# Altium schematic sheet fillcap_driver.SchDoc: Driver
size A3; DrawnBy: daniw / ninux; Organization: HSLU T&A; Address1: Abteilung Elektrotechnik; Address2: Technikumsstrasse 21; Address3: CH-6048 Horw; SheetNumber: 2; SheetTotal: 9; Projektname: fillcap
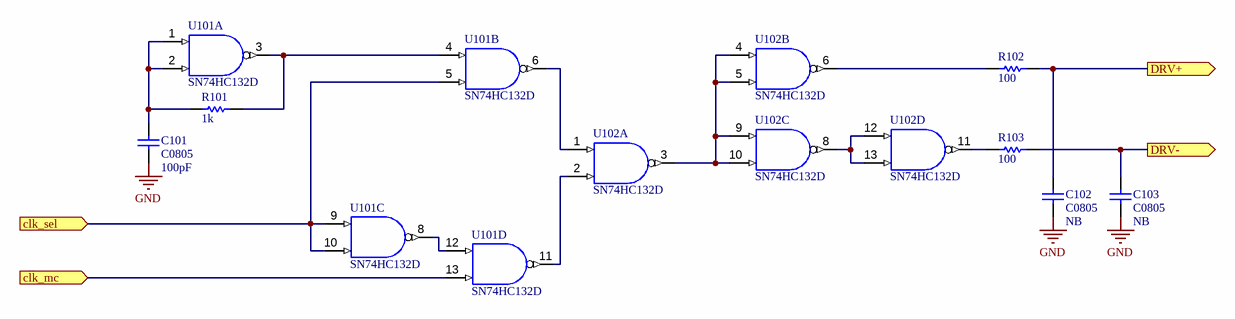
[diagram p0: fillcap_driver.SchDoc]

## Parts
C101  C0805  value 100pF  [0805]
C102  C0805  value NB  [0805]
C103  C0805  value NB  [0805]
R101  1k  [ERA-0805]
R102  100  [ERA-0805]
R103  100  [ERA-0805]
U101  SN74HC132D  [D014_N]  (parts A,B,C,D of 4)
U102  SN74HC132D  [D014_N]  (parts A,B,C,D of 4)

## Ports
clk_mc (in), clk_sel (in), DRV+ (out), DRV- (out)

## Nets
GND: C101.1 C102.1 C103.1 U101.7(GND) U102.7(GND)
VCC: U101.14(VCC) U102.14(VCC)
clk_mc: U101.13(B) ; port clk_mc
clk_sel: U101.5(B) U101.9(A) U101.10(B) ; port clk_sel
DRV+: C102.2 R102.2 ; port DRV+
DRV-: C103.2 R103.2 ; port DRV-
NetC101_2: C101.2 R101.1 U101.1(A) U101.2(B)
NetR101_2: R101.2 U101.3(Y) U101.4(A)
NetR102_1: R102.1 U102.6(Y)
NetR103_1: R103.1 U102.11(Y)
NetU101_6: U101.6(Y) U102.1(A)
NetU101_8: U101.8(Y) U101.12(A)
NetU101_11: U101.11(Y) U102.2(B)
NetU102_3: U102.3(Y) U102.4(A) U102.5(B) U102.9(A) U102.10(B)
NetU102_8: U102.8(Y) U102.12(A) U102.13(B)

## Notes on the sheet
- Project:
- Drawn by:
- Size:
- Sheet
- A3
- Rev.:
- of
- Date:
- File:

## Library data of the parts
C101-C103 = C0805: Ceramic Chip Capacitor - Standard; Note: Footprint corresponds to dimensions for bulk cassette packaging. This case size has tightened tolerances.; Published: 17-Jul-2002; LatestRevisionDate: 19-Mar-2004; LatestRevisionNote: Silkscreen size reduced.; DatasheetDocument: Mar-2001; PackageDocument: Mar-2001; PackageReference: 0805; Publisher: Altium Limited; Code_JEITA: 0805; Code_IPC: 2012[0805]; ComponentLink1Description: Manufacturer Link; ComponentLink1URL: http://www.kemet.com/; ComponentLink2Description: Datasheet; ComponentLink2URL: http://www.kemet.com/kemet/web/homepage/kechome.nsf/vapubfilesname/F3102TA.pdf/$file/F3102TA.pdf
R101-R103 = ERAS: Metal Film Thermosensitive Chip Resistor, 0.56 Ohm to 10k Ohm Range, 5% Tolerance, 0805 Size, 0.1 W; Note: If flow soldering, adjust pad width of PCB Footprint to 0.7 - 0.8 times the width of the resistor.; Published: 17-Dec-2003; LatestRevisionDate: 19-Mar-2004; LatestRevisionNote: Silkscreen size reduced.; PackageDocument: Mar-2003; PackageReference: ERA-0805; Publisher: Altium Limited; Code_IPC: 2012 [0805]; ComponentLink1Description: Manufacturer Link; ComponentLink1URL: http://www.panasonic.com/industrial/components/resistive_products.htm; ComponentLink2Description: Datasheet; ComponentLink2URL: http://www.panasonic.com/industrial/components/pdf/AOF0000CE1.pdf
U101 U102 = SN74HC132D: Quadruple Positive-NAND Gate with Schmitt-Trigger Inputs; Published: 8-Jun-2000; LatestRevisionDate: 13-Apr-2006; LatestRevisionNote: IPC-7351 Footprint Added.; DatasheetVersion: May-1997; PackageVersion: Jan-1998; PackageReference: D014; Publisher: Altium Limited; PackageDescription: 14-Pin Small Outline Integrated Circuit 1.27 mm Pitch; Code_IPC: SOIC127P600-14; ComponentLink1Description: Manufacturer Link; ComponentLink1URL: http://www.ti.com/; ComponentLink2Description: Datasheet; ComponentLink2URL: http://www-s.ti.com/sc/ds/sn74hc132.pdf